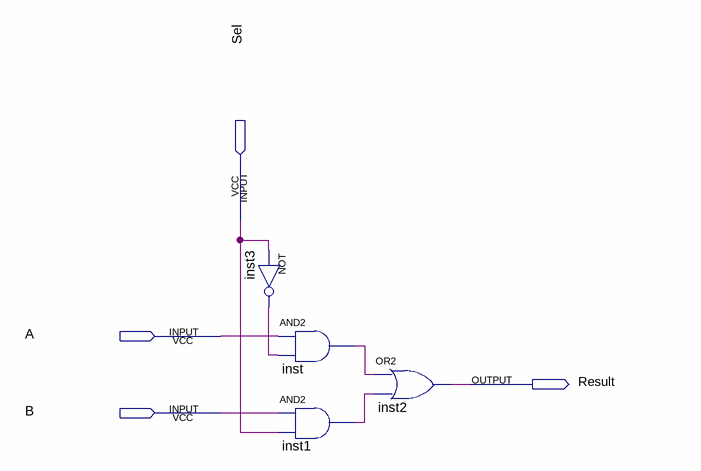
[diagram p0: schematic sheet]
// Quartus schematic mux2_1bit.bdf as structural Verilog: 4 symbols, 4 pins
module mux2_1bit (
  input  Sel,
  input  A,
  input  B,
  output Result
);

  wire inst1_out, inst3_out, inst_out;

  not inst3 (inst3_out, Sel);
  and inst (inst_out, A, inst3_out);
  and inst1 (inst1_out, B, Sel);
  or inst2 (Result, inst_out, inst1_out);
endmodule
